# Altium schematic sheet IMU_Micro-F103.SchDoc
size A4
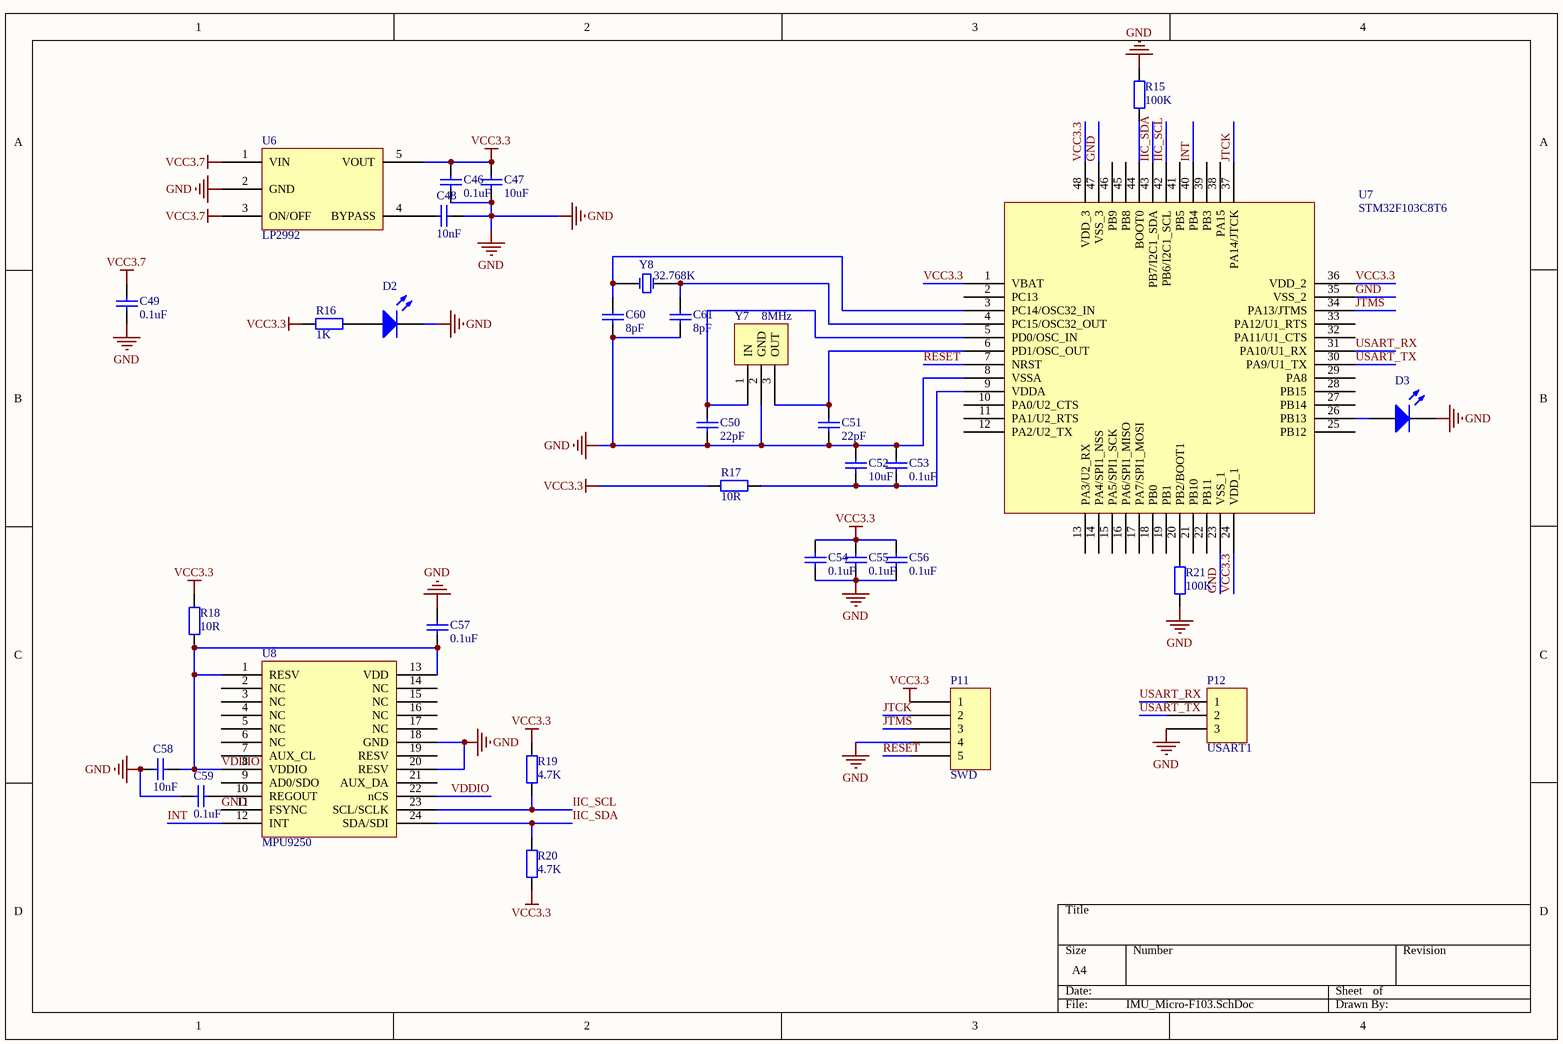
[diagram p0: IMU_Micro-F103.SchDoc]

## Parts
C46  0.1uF  [C 0402_M]
C47  10uF  [C 0402_M]
C48  10nF  [C 0402_M]
C49  0.1uF  [C 0402_M]
C50  22pF  [C 0402_M]
C51  22pF  [C 0402_M]
C52  10uF  [C 0402_M]
C53  0.1uF  [C 0402_M]
C54  0.1uF  [C 0402_M]
C55  0.1uF  [C 0402_M]
C56  0.1uF  [C 0402_M]
C57  0.1uF  [C 0402_M]
C58  10nF  [C 0402_M]
C59  0.1uF  [C 0402_M]
C60  8pF  [C 0402_M]
C61  8pF  [C 0402_M]
D2  LED0  [R 0402_M]  (value not drawn)
D3  LED0  [R 0402_M]  (value not drawn)
P11  SWD  [HDR2.54-M-LI-5P]
P12  USART1  [HDR2.54-M-LI-3P]
R15  100K  [R 0402_M]
R16  1K  [R 0402_M]
R17  10R  [R 0402_M]
R18  10R  [R 0402_M]
R19  4.7K  [R 0402_M]
R20  4.7K  [R 0402_M]
R21  100K  [R 0402_M]
U6  LP2992  [SOT23-5M]
U7  STM32F103C8T6  [LQFP48]
U8  MPU9250  [QFN24 3*3]
Y7  8MHz  [SMD 3213-3P]
Y8  32.768K  [SMD1610-2P]

## Nets
GND: C46.2 C47.2 C48.2 C49.2 C50.2 C51.2 C52.1 C53.1 C54.2 C55.2 C56.2 C57.2 C58.1 C59.1 C60.2 C61.2 D2.2(K) D3.2(K) P11.4 P12.3 R15.1 R21.2 U6.2(GND) U7.8(VSSA) U7.23(VSS_1) U7.35(VSS_2) U7.47(VSS_3) U8.11(FSYNC) U8.18(GND) U8.20(RESV) Y7.2(GND)
VCC3.3: C46.1 C47.1 C54.1 C55.1 C56.1 P11.1 R16.2 R17.1 R18.1 R19.2 R20.1 U6.5(VOUT) U7.1(VBAT) U7.24(VDD_1) U7.36(VDD_2) U7.48(VDD_3)
VCC3.7: C49.1 U6.1(VIN) U6.3(ON/OFF)
IIC_SCL: R19.1 U7.42(PB6/I2C1_SCL) U8.23(SCL/SCLK)
IIC_SDA: R20.2 U7.43(PB7/I2C1_SDA) U8.24(SDA/SDI)
INT: U7.40(PB4) U8.12(INT)
JTCK: P11.2 U7.37(PA14/JTCK)
JTMS: P11.3 U7.34(PA13/JTMS)
RESET: P11.5 U7.7(NRST)
USART_RX: P12.1 U7.31(PA10/U1_RX)
USART_TX: P12.2 U7.30(PA9/U1_TX)
VDDIO: C57.1 C58.2 R18.2 U8.1(RESV) U8.8(VDDIO) U8.13(VDD) U8.22(nCS)
NetC48_1: C48.1 U6.4(BYPASS)
NetC50_1: C50.1 U7.5(PD0/OSC_IN) Y7.1(IN)
NetC51_1: C51.1 U7.6(PD1/OSC_OUT) Y7.3(OUT)
NetC52_2: C52.2 C53.2 R17.2 U7.9(VDDA)
NetC59_2: C59.2 U8.10(REGOUT)
NetC60_1: C60.1 U7.3(PC14/OSC32_IN) Y8.1(OSC1)
NetC61_1: C61.1 U7.4(PC15/OSC32_OUT) Y8.2(OSC2)
NetD2_1: D2.1(A) R16.1
NetD3_1: D3.1(A) U7.26(PB13)
NetR15_2: R15.2 U7.44(BOOT0)
NetR21_1: R21.1 U7.20(PB2/BOOT1)

Not connected (* = marked no-connect by the designer): U7 2(PC13) 10(PA0/U2_CTS) 11(PA1/U2_RTS) 12(PA2/U2_TX) 13(PA3/U2_RX) 14(PA4/SPI1_NSS) 15(PA5/SPI1_SCK) 16(PA6/SPI1_MISO) 17(PA7/SPI1_MOSI) 18(PB0) 19(PB1) 21(PB10) 22(PB11) 25(PB12) 27(PB14) 28(PB15) 29(PA8) 32(PA11/U1_CTS) 33(PA12/U1_RTS) 38(PA15) 39(PB3) 41(PB5) 45(PB8) 46(PB9); U8 2(NC) 3(NC) 4(NC) 5(NC) 6(NC) 7(AUX_CL) 9(AD0/SDO) 14(NC) 15(NC) 16(NC) 17(NC) 19(RESV) 21(AUX_DA)

## Library data of the parts
C46-C61 = Cap: Capacitor; Value: 100pF; Published: 8-Jun-2000; LatestRevisionDate: 17-Jul-2002; LatestRevisionNote: Re-released for DXP Platform.; PackageReference: RAD-0.3; Publisher: Altium Limited; PackageDescription: Radial Cap, Thru-Hole; 2 Leads; 0.3 in Pin Spacing
D2 D3 = LED0: Typical INFRARED GaAs LED; Published: 8-Jun-2000; LatestRevisionDate: 08-Jul-2005; LatestRevisionNote: Mech Layer 1 removed.; PackageReference: LED-0; Publisher: Altium Limited; PackageDescription: LED; 2 Leads
P12 = USART
R15 R17-R21 = Res2: Resistor; Value: 1K; Published: 8-Jun-2000; LatestRevisionDate: 17-Jul-2002; LatestRevisionNote: Re-released for DXP Platform.; PackageReference: AXIAL-0.4; Publisher: Altium Limited; PackageDescription: Axial Device, Thru-Hole; 2 Leads; 0.4 in Pin Spacing
R16 = Res2: Resistor; Published: 8-Jun-2000; LatestRevisionDate: 17-Jul-2002; LatestRevisionNote: Re-released for DXP Platform.; PackageReference: AXIAL-0.4; Publisher: Altium Limited; PackageDescription: Axial Device, Thru-Hole; 2 Leads; 0.4 in Pin Spacing; Value: 1K
U7 = STM32F103CBT6
Y7 = Y_3Pin
Y8 = XTAL: Crystal Oscillator; Published: 8-Jun-2000; LatestRevisionDate: 17-Jul-2002; LatestRevisionNote: Re-released for DXP Platform.; PackageReference: R38; Publisher: Altium Limited; PackageDescription: Crystal, Thru-Hole; 2 Leads; Body 3.1 x 8.2 mm (Dia.xH)